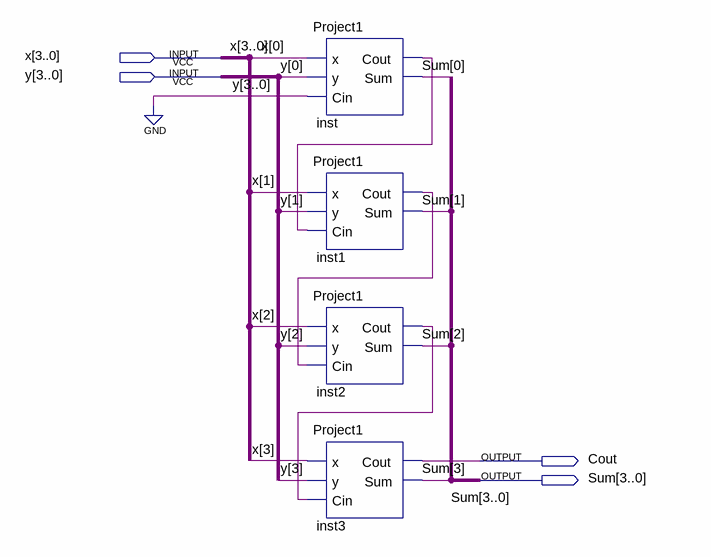
[diagram p0: schematic sheet]
// Quartus schematic Project2.bdf as structural Verilog: 4 symbols, 4 pins
module Project2 (
  input  [3:0] x,
  input  [3:0] y,
  output Cout,
  output [3:0] Sum
);

  wire inst1_cout, inst2_cout, inst_cout;

  Project1 inst (.x(x[0]), .y(y[0]), .Cin(1'b0), .Cout(inst_cout), .Sum(Sum[0]));
  Project1 inst1 (.x(x[1]), .y(y[1]), .Cin(inst_cout), .Cout(inst1_cout), .Sum(Sum[1]));
  Project1 inst2 (.x(x[2]), .y(y[2]), .Cin(inst1_cout), .Cout(inst2_cout), .Sum(Sum[2]));
  Project1 inst3 (.x(x[3]), .y(y[3]), .Cin(inst2_cout), .Cout(Cout), .Sum(Sum[3]));
endmodule
